# Altium project IP5328P BMS.PrjPcb
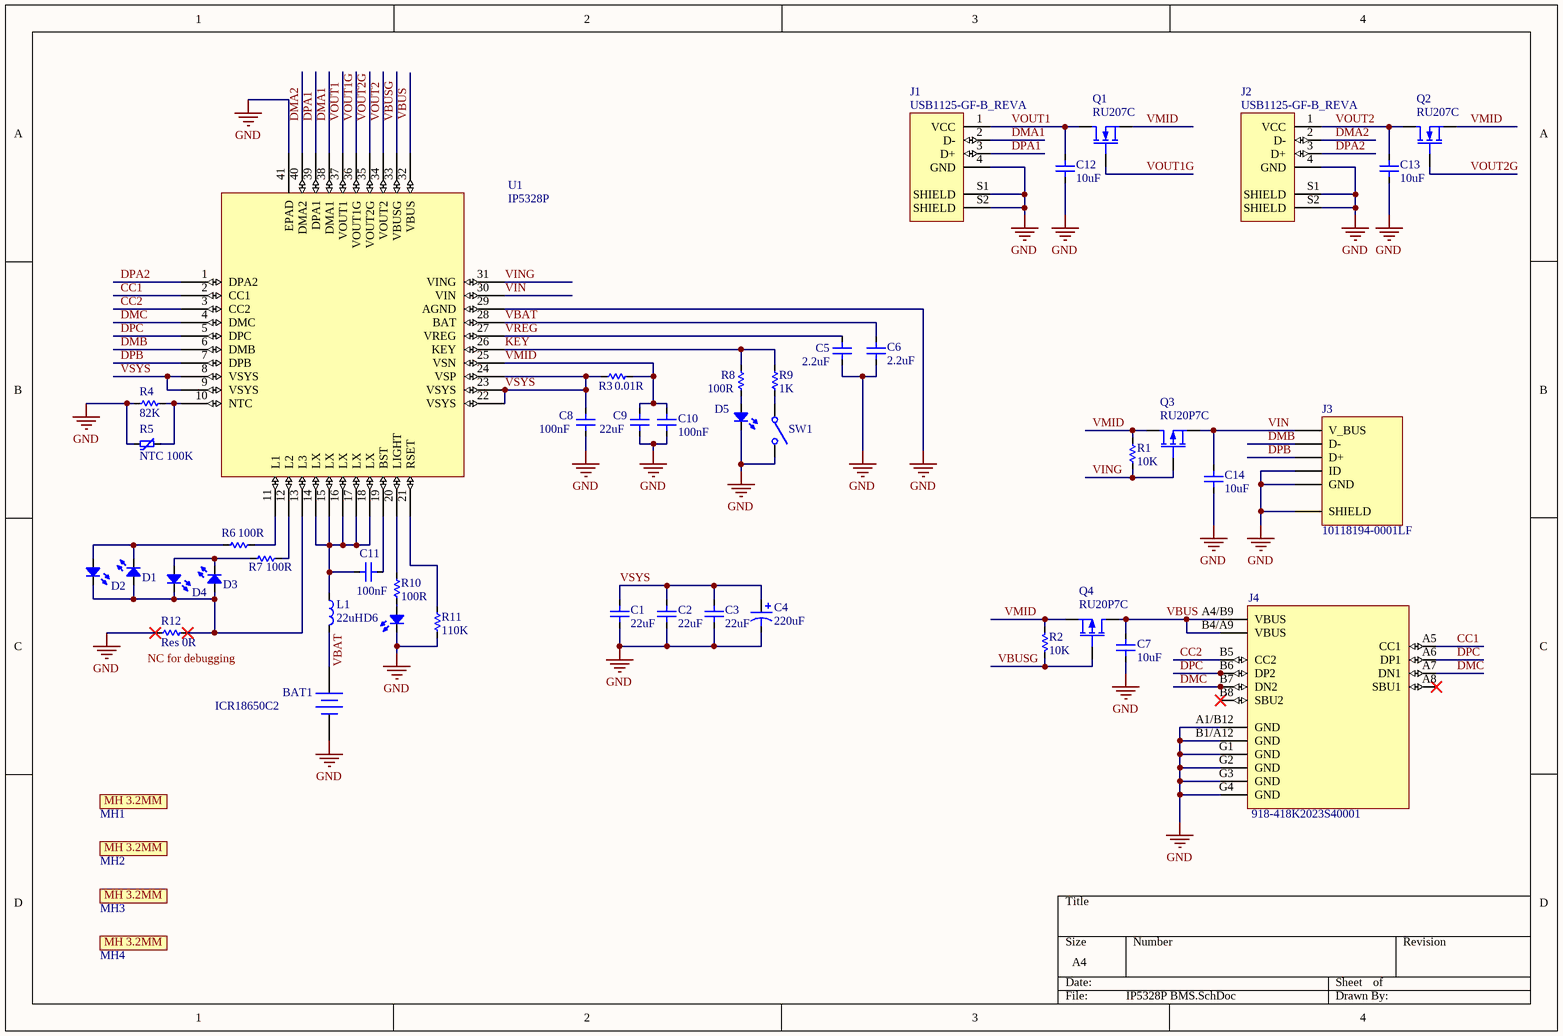
[diagram p0: IP5328P BMS.SchDoc]
1 sheet, 48 parts. Net scope: global (net labels, ports and power ports of the same name join across sheets).
Board file: IP5328P BMS.PcbDoc

## Sheet IP5328P BMS.SchDoc
size A4; SheetNumber: 1; SheetTotal: 1

### Parts
BAT1  ICR18650C2  [Battery Wire Pads]
C1  22uF  [CAP 2012[0805]]
C2  22uF  [CAP 2012[0805]]
C3  22uF  [CAP 2012[0805]]
C4  220uF  [Capacitor]
C5  2.2uF  [CAP 2012[0805]]
C6  2.2uF  [CAP 2012[0805]]
C7  10uF  [CAP 2012[0805]]
C8  100nF  [CAP 2012[0805]]
C9  22uF  [CAP 2012[0805]]
C10  100nF  [CAP 2012[0805]]
C11  100nF  [CAP 2012[0805]]
C12  10uF  [CAP 2012[0805]]
C13  10uF  [CAP 2012[0805]]
C14  10uF  [CAP 2012[0805]]
D1  SZYY0603G  [LED 0603]  (value not drawn)
D2  SZYY0603G  [LED 0603]  (value not drawn)
D3  SZYY0603G  [LED 0603]  (value not drawn)
D4  SZYY0603G  [LED 0603]  (value not drawn)
D5  SZYY0603G  [LED 0603]  (value not drawn)
D6  SZYY0603G  [LED 0603]  (value not drawn)
J1  USB1125-GF-B_REVA  [GCT_USB1125-GF-B_REVA]
J2  USB1125-GF-B_REVA  [GCT_USB1125-GF-B_REVA]
J3  10118194-0001LF  [AMPHENOL_10118194-0001LF]
J4  918-418K2023S40001  [918-418K2023S40001]
L1  22uH  [YSPI1050-2R2M]
MH1  MH 3.2MM W/CLEARANCE  [3.2mm Mounting Hole w/clearance]  (value not drawn)
MH2  MH 3.2MM W/CLEARANCE  [3.2mm Mounting Hole w/clearance]  (value not drawn)
MH3  MH 3.2MM W/CLEARANCE  [3.2mm Mounting Hole w/clearance]  (value not drawn)
MH4  MH 3.2MM W/CLEARANCE  [3.2mm Mounting Hole w/clearance]  (value not drawn)
Q1  RU207C  [SOT-23-3]
Q2  RU207C  [SOT-23-3]
Q3  RU20P7C  [SOT-23-3]
Q4  RU20P7C  [SOT-23-3]
R1  10K  [RES 1608[0603]]
R2  10K  [RES 1608[0603]]
R3  0.01R  [RES 3225[1210]]
R4  82K  [RES 1608[0603]]
R5  NTC 100K  [temp through hole component]
R6  100R  [RES 1608[0603]]
R7  100R  [RES 1608[0603]]
R8  100R  [RES 1608[0603]]
R9  1K  [RES 1608[0603]]
R10  100R  [RES 1608[0603]]
R11  110K  [RES 1608[0603]]
R12  Res 0R  [RES 1608[0603] EMPTY]
SW1  Switch SPST  [TACTILE SW NO]  (value not drawn)
U1  IP5328P  [QFN-40 6x6mm EP]

### Nets
GND: BAT1.2(-) C1.1 C2.1 C3.1 C4.2 C5.1 C6.1 C7.1 C8.2 C9.2 C10.2 C12.1 C13.1 C14.1 D5.2(K) D6.2(K) J1.4(GND) J1.S1(SHIELD) J1.S2(SHIELD) J2.4(GND) J2.S1(SHIELD) J2.S2(SHIELD) J3.4(ID) J3.5(GND) J3.S1(SHIELD) J4.A1/B12(GND) J4.B1/A12(GND) J4.G1(GND) J4.G2(GND) J4.G3(GND) J4.G4(GND) R4.1 R5.1 R11.2 R12.1 SW1.2(NO) U1.29(AGND) U1.41(EPAD)
CC1: J4.A5(CC1) U1.2(CC1)
CC2: J4.B5(CC2) U1.3(CC2)
DMA1: J1.2(D-) U1.38(DMA1)
DMA2: J2.2(D-) U1.40(DMA2)
DMB: J3.2(D-) U1.6(DMB)
DMC: J4.A7(DN1) J4.B7(DN2) U1.4(DMC)
DPA1: J1.3(D+) U1.39(DPA1)
DPA2: J2.3(D+) U1.1(DPA2)
DPB: J3.3(D+) U1.7(DPB)
DPC: J4.A6(DP1) J4.B6(DP2) U1.5(DPC)
KEY: R8.2 R9.2 U1.26(KEY)
VBAT: BAT1.1(+) C6.2 L1.2 U1.28(BAT)
VBUS: C7.2 J4.A4/B9(VBUS) J4.B4/A9(VBUS) Q4.1(D) U1.32(VBUS)
VBUSG: Q4.2(G) R2.1 U1.33(VBUSG)
VIN: C14.2 J3.1(V_BUS) Q3.3(S) U1.30(VIN)
VING: Q3.2(G) R1.1 U1.31(VING)
VMID: C9.1 C10.1 Q1.3(S) Q2.3(S) Q3.1(D) Q4.3(S) R1.2 R2.2 R3.1 U1.25(VSN)
VOUT1: C12.2 J1.1(VCC) Q1.1(D) U1.37(VOUT1)
VOUT1G: Q1.2(G) U1.36(VOUT1G)
VOUT2: C13.2 J2.1(VCC) Q2.1(D) U1.34(VOUT2)
VOUT2G: Q2.2(G) U1.35(VOUT2G)
VREG: C5.2 U1.27(VREG)
VSYS: C1.2 C2.2 C3.2 C4.1 C8.1 R3.2 U1.8(VSYS) U1.9(VSYS) U1.22(VSYS) U1.23(VSYS) U1.24(VSP)
NetC11_1: C11.1 U1.19(BST)
NetC11_2: C11.2 L1.1 U1.14(LX) U1.15(LX) U1.16(LX) U1.17(LX) U1.18(LX)
NetD1_1: D1.1(A) D2.2(K) D3.1(A) D4.2(K) R12.2 U1.13(L3)
NetD1_2: D1.2(K) D2.1(A) R6.2
NetD3_2: D3.2(K) D4.1(A) R7.1
NetD5_1: D5.1(A) R8.1
NetD6_1: D6.1(A) R10.2
NetR4_2: R4.2 R5.2 U1.10(NTC)
NetR6_1: R6.1 U1.11(L1)
NetR7_2: R7.2 U1.12(L2)
NetR9_1: R9.1 SW1.1(COMMON)
NetR10_1: R10.1 U1.20(LIGHT)
NetR11_1: R11.1 U1.21(RSET)

Not connected (* = marked no-connect by the designer): J4 A8(SBU1)* B8(SBU2)*

### Notes on the sheet
- (near R12) NC for debugging
- (in symbol MH 3.2MM W/CLEARANCE) MH 3.2MM

### Library data of the parts
BAT1 = Battery Multi: Lithium Ion ICR18650 C2 2800mAh
C1-C3 C9 = Cap 22uF: X5R 25V ±20% 22uF 0805 Multilayer Ceramic Capacitors MLCC - SMD/SMT ROHS; Vendor: JLCPCB; Vendor PN: C45783; Mfg: Samsung Electro-Mechanics; Mfg PN: CL21A226MAQNNNE
C4 = Cap 220uH Polarized
C5 C6 = Cap 2.2uF: 25V 2.2uF X5R ±10% 0805 Multilayer Ceramic Capacitors MLCC - SMD/SMT ROHS; Vendor: JLCPCB; Vendor PN: C87994; Mfg: Samsung Electro-Mechanics; Mfg PN: CL21A225KAFNNNE
C7 C12-C14 = Cap 10uF: X5R 25V ±10% 10uF 0805 Multilayer Ceramic Capacitors MLCC - SMD/SMT ROHS; Vendor: JLCPCB; Vendor PN: C15850; Mfg: Samsung Electro-Mechanics; Mfg PN: CL21A106KAYNNNE
C8 C10 C11 = Cap 100nF: 100V 100nF X7R ±10% 0805 Multilayer Ceramic Capacitors MLCC - SMD/SMT ROHS; Vendor: JLCPCB; Vendor PN: C28233; Mfg: Samsung Electro-Mechanics; Mfg PN: CL21B104KCFNNNE
D1-D6 = LED: Emerald 0603 Light Emitting Diodes (LED) ROHS; Mfg: Yongyu Photoelectric; Vendor: JLCPCB; Vendor PN: C434420; Mfg PN: SZYY0603G
J1 J2 = USB1125-GF-B_REVA: USB 2.0 Receptacle, Type A,Through Hole, Horizontal, Top Mount, Without Flange; MF: Global Connector Technology; Value: *; SnapEDA_Link: https://www.snapeda.com/parts/USB1125-GF-B/Global%20Connector%20Technology/view-part/4792084/?ref=snap; Price: None; Availability: Unavailable; Package: Package; MP: USB1125-GF-B
J3 = 10118194-0001LF: USB - micro B USB 2.0 Receptacle Connector 5 Position Surface Mount, Right Angle; Through Hole; MF: Amphenol ICC; Package: None; Price: None; Availability: Unavailable; MP: 10118194-0001LF; SnapEDA_Link: https://www.snapeda.com/parts/10118194-0001LF/Amphenol%20FCI/view-part/1413308/?ref=snap; Value: *
J4 = 918-418K2023S40001: 3A 1 16 Female Type-C SMD USB Connectors ROHS; Mfg: Jing Extension of the Electronic Co.; Vendor: JLCPCB; Vendor PN: C167321; Mfg PN: 918-418K2023S40001
L1 = Power Inductor 22uH: 10A 2.2uH ±20% 6.6mΩ SMD,11.5x10x5mm Power Inductors ROHS; Mfg: YJYCOIN; Vendor: JLCPCB; Vendor PN: C497893; Mfg PN: YSPI1050-2R2M
Q1 Q2 = RU207C: SOT-23-3 MOSFETs ROHS 20V/6A,; Mfg: Shenzhen ruichips Semicon; Vendor: LCSC; Vendor PN: C515680; Mfg PN: RU207C
Q3 Q4 = RU20P7C: 20V 5A 28mΩ@4.5V,5A 1.3W 1.1V@250μA P Channel SOT-23(SOT-23-3) MOSFETs ROHS; Mfg: Shenzhen ruichips Semicon; Vendor: LCSC; Vendor PN: C181984; Mfg PN: RU20P7C
R1 R2 = Res 10K: ±1% 1/10W Thick Film Resistors 75V ±100ppm/℃ -55℃~+155℃ 10kΩ 0603 Chip Resistor - Surface Mount ROHS; Vendor: JLCPCB; Vendor PN: C25804; Mfg: UNI-ROYAL(Uniroyal Elec); Mfg PN: 0603WAF1002T5E
R3 = Res 0.01R: ±1% 1/2W Thick Film Resistors 200V ±1500ppm/℃ -55℃~+155℃ 0.01Ω 1210 Chip Resistor - Surface Mount ROHS; Vendor: JLCPCB; Vendor PN: C159310; Mfg: RALEC; Mfg PN: RTT12R010FTP
R4 = Res 82K: ±1% 1/10W Thick Film Resistors 75V ±100ppm/℃ -55℃~+155℃ 82kΩ 0603 Chip Resistor - Surface Mount ROHS; Vendor: JLCPCB; Vendor PN: C23254; Mfg: UNI-ROYAL(Uniroyal Elec); Mfg PN: 0603WAF8202T5E
R5 = Thermistor 100K: THERM NTC 100KOHM 4250K BEAD; Mfg: Murata Electronics; Mfg PN: NXFT15WF104FA1B025; Vendor: Digikey; Vendor PN: 490-11856-ND
R6-R8 R10 = Res 100R: ±1% 1/10W Thick Film Resistors 75V ±200ppm/℃ -55℃~+155℃ 100Ω 0603 Chip Resistor - Surface Mount ROHS; Vendor: JLCPCB; Vendor PN: C22775; Mfg: UNI-ROYAL(Uniroyal Elec); Mfg PN: 0603WAF1000T5E
R9 = Res 1K: ±1% 1/10W Thick Film Resistors 75V ±100ppm/℃ -55℃~+155℃ 1kΩ 0603 Chip Resistor - Surface Mount ROHS; Vendor: JLCPCB; Vendor PN: C21190; Mfg: UNI-ROYAL(Uniroyal Elec); Mfg PN: 0603WAF1001T5E
R11 = Res 110K: ±1% 1/10W Thick Film Resistors 75V ±100ppm/℃ -55℃~+155℃ 110kΩ 0603 Chip Resistor - Surface Mount ROHS; Vendor: JLCPCB; Vendor PN: C25805; Mfg: UNI-ROYAL(Uniroyal Elec); Mfg PN: 0603WAF1103T5E
SW1 = Switch SPST: Tactile Switch SPST-NO Top Actuated Surface Mount; Mfg: E-Switch; Mfg PN: TL3305AF260QG; Vendor: Digikey; Vendor PN: EG5353TR-ND
U1 = IP5328P: QFN-40_6x6x05P Battery Management ICs ROHS; Mfg: INJOINIC; Vendor: JLCPCB; Vendor PN: C188809; Mfg PN: IP5328P